# Altium schematic sheet dclass.SCHDOC
size B
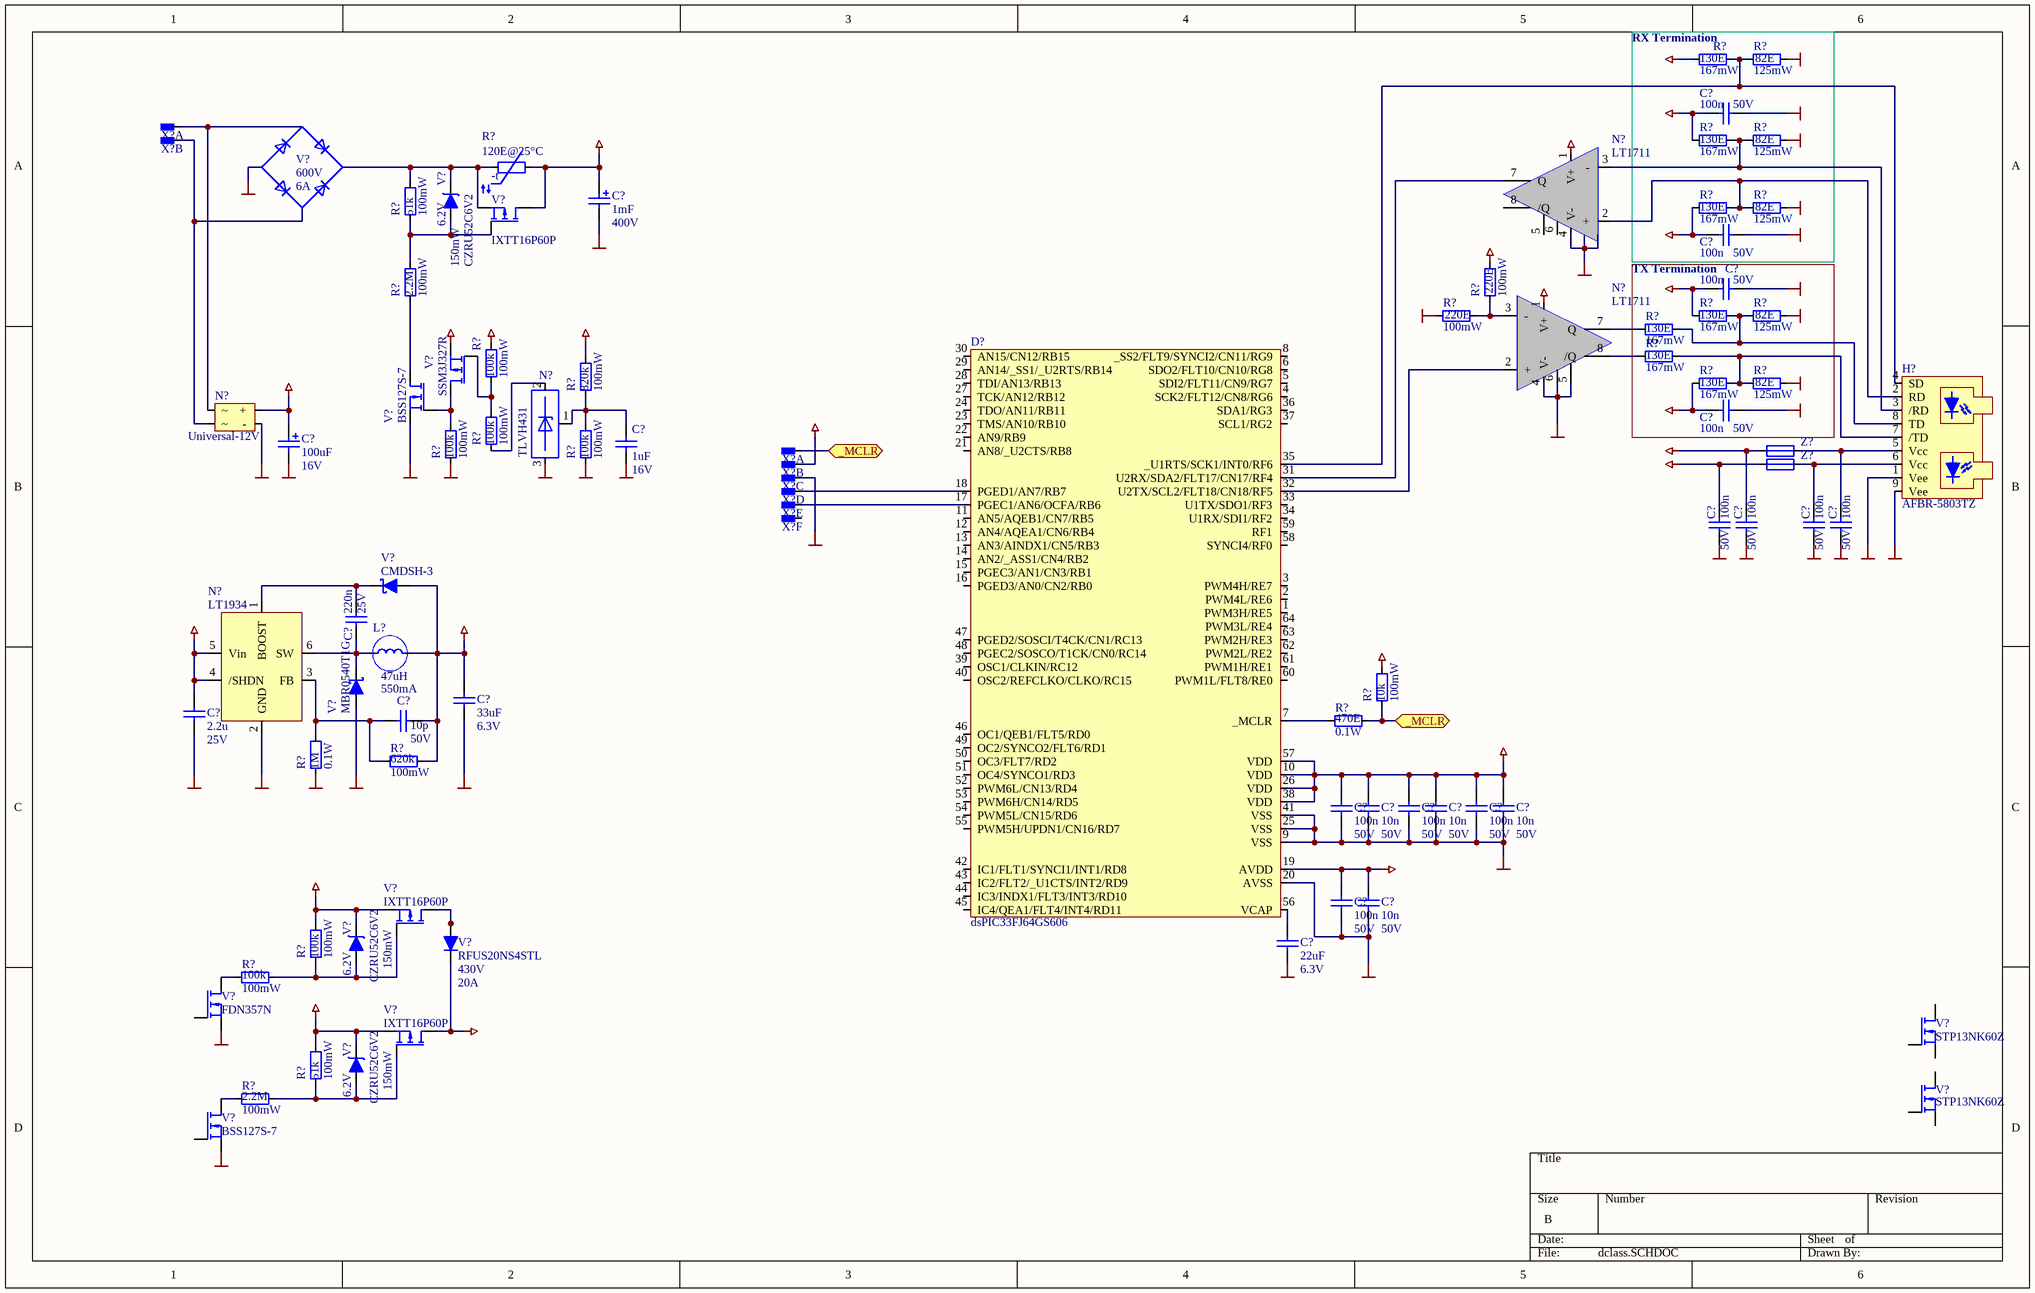
[diagram p0: dclass.SCHDOC]

## Parts
(Parts that share a designator on the sheet are numbered #1, #2 ... from top to bottom, then left to right.)
C?#1  value 100n  Value2: 50V  [SMD_0603]  (hidden comment: C_SMD_CER_100N_50V_10%_X7R_0603)
C?#2  value 1mF  Value2: 400V  [THT_CAP_T2GP102FA]  (hidden comment: C_THT_ALU_1000U_400V_20%_T2GP102FA)
C?#3  value 100n  Value2: 50V  [SMD_0603]  (hidden comment: C_SMD_CER_100N_50V_10%_X7R_0603)
C?#4  value 100n  Value2: 50V  [SMD_0603]  (hidden comment: C_SMD_CER_100N_50V_10%_X7R_0603)
C?#5  value 100n  Value2: 50V  [SMD_0603]  (hidden comment: C_SMD_CER_100N_50V_10%_X7R_0603)
C?#6  value 100uF  Value2: 16V  [SMD_7343P]  (hidden comment: C_SMD_TAN_100U_16V_20%_7343)
C?#7  value 1uF  Value2: 16V  [SMD_0603]  (hidden comment: C_SMD_CER_1U_16V_10%_X5R_0603)
C?#8  value 100n  Value2: 50V  [SMD_0603]  (hidden comment: C_SMD_CER_100N_50V_10%_X7R_0603)
C?#9  value 100n  Value2: 50V  [SMD_0603]  (hidden comment: C_SMD_CER_100N_50V_10%_X7R_0603)
C?#10  value 100n  Value2: 50V  [SMD_0603]  (hidden comment: C_SMD_CER_100N_50V_10%_X7R_0603)
C?#11  value 100n  Value2: 50V  [SMD_0603]  (hidden comment: C_SMD_CER_100N_50V_10%_X7R_0603)
C?#12  value 220n  Value2: 25V  [SMD_0603]  (hidden comment: C_SMD_CER_220N_25V_10%_X5R_0603)
C?#13  value 10p  Value2: 50V  [SMD_0603]  (hidden comment: C_SMD_CER_10P_50V_5%_NP0_0603)
C?#14  value 33uF  Value2: 6.3V  [SMD_1206]  (hidden comment: C_SMD_CER_33U_6V3_20%_X5R_1206)
C?#15  value 2.2u  Value2: 25V  [SMD_0603]  (hidden comment: C_SMD_CER_2U2_25V_10%_X5R_0603)
C?#16  value 100n  Value2: 50V  [SMD_0603]  (hidden comment: C_SMD_CER_100N_50V_10%_X7R_0603)
C?#17  value 10n  Value2: 50V  [SMD_0603]  (hidden comment: C_SMD_CER_10N_50V_10%_X7R_0603)
C?#18  value 100n  Value2: 50V  [SMD_0603]  (hidden comment: C_SMD_CER_100N_50V_10%_X7R_0603)
C?#19  value 10n  Value2: 50V  [SMD_0603]  (hidden comment: C_SMD_CER_10N_50V_10%_X7R_0603)
C?#20  value 100n  Value2: 50V  [SMD_0603]  (hidden comment: C_SMD_CER_100N_50V_10%_X7R_0603)
C?#21  value 10n  Value2: 50V  [SMD_0603]  (hidden comment: C_SMD_CER_10N_50V_10%_X7R_0603)
C?#22  value 100n  Value2: 50V  [SMD_0603]  (hidden comment: C_SMD_CER_100N_50V_10%_X7R_0603)
C?#23  value 10n  Value2: 50V  [SMD_0603]  (hidden comment: C_SMD_CER_10N_50V_10%_X7R_0603)
C?#24  value 22uF  Value2: 6.3V  [SMD_1206]  (hidden comment: C_SMD_CER_22U_6V3_20%_X5R_1206)
D?  Type: dsPIC33FJ64GS606  [SMD_TQFP-64]  (hidden comment: D_DSPIC33FJ64GS606_TQFP-64)
H?  Type: AFBR-5803TZ  [THT_AFBR-5803TZ]  (hidden comment: H_OPTO_TRANSCEIVER_ST_3V3_100MBPS_1300NM)
L?  value 47uH  Value2: 550mA  [SMD_INDUCT-74404041470]  (hidden comment: L_SMD_47U_0A55_20%)
N?#1  Type: LT1711  [SMD_SOP_8]  (hidden comment: N_LT1711_SOP-8)
N?#2  Type: LT1711  [SMD_SOP_8]  (hidden comment: N_LT1711_SOP-8)
N?#3  Type: Universal-12V  [THT_VCP24US12-E]  (hidden comment: N_SMPS_265AC-to-12V_24W)
N?#4  Type: TLVH431  [SMD_SOT_23_3]  (hidden comment: N_TLVH431_SOT23-3)
N?#5  LT1934  [SMD_SOT_23_6]
R?#1  value 130E  Value2: 167mW  [SMD_0603]  (hidden comment: R_SMD_THINFILM_130E_0W16_0.1%_25PPM_0603)
R?#2  value 82E  Value2: 125mW  [SMD_0603]  (hidden comment: R_SMD_THINFILM_82E_0W125_1%_50PPM_0603)
R?#3  value 130E  Value2: 167mW  [SMD_0603]  (hidden comment: R_SMD_THINFILM_130E_0W16_0.1%_25PPM_0603)
R?#4  value 82E  Value2: 125mW  [SMD_0603]  (hidden comment: R_SMD_THINFILM_82E_0W125_1%_50PPM_0603)
R?#5  value 120E@25°C  [THT_R_A_L17.5_D6_P10]  (hidden comment: R_THT_NTC_120E_20%)
R?#6  value 130E  Value2: 167mW  [SMD_0603]  (hidden comment: R_SMD_THINFILM_130E_0W16_0.1%_25PPM_0603)
R?#7  value 82E  Value2: 125mW  [SMD_0603]  (hidden comment: R_SMD_THINFILM_82E_0W125_1%_50PPM_0603)
R?#8  value 51k  Value2: 100mW  [SMD_0603]  (hidden comment: R_SMD_THINFILM_51K_0W1_1%_50PPM_0603)
R?#9  value 2.2M  Value2: 100mW  [SMD_0603]  (hidden comment: R_SMD_THINFILM_2M2_0W1_1%_50PPM_0603)
R?#10  value 220E  Value2: 100mW  [SMD_0603]  (hidden comment: R_SMD_THINFILM_220E_0W1_1%_50PPM_0603)
R?#11  value 220E  Value2: 100mW  [SMD_0603]  (hidden comment: R_SMD_THINFILM_220E_0W1_1%_50PPM_0603)
R?#12  value 130E  Value2: 167mW  [SMD_0603]  (hidden comment: R_SMD_THINFILM_130E_0W16_0.1%_25PPM_0603)
R?#13  value 82E  Value2: 125mW  [SMD_0603]  (hidden comment: R_SMD_THINFILM_82E_0W125_1%_50PPM_0603)
R?#14  value 130E  Value2: 167mW  [SMD_0603]  (hidden comment: R_SMD_THINFILM_130E_0W16_0.1%_25PPM_0603)
R?#15  value 100k  Value2: 100mW  [SMD_0603]  (hidden comment: R_SMD_THINFILM_100K_0W1_1%_50PPM_0603)
R?#16  value 130E  Value2: 167mW  [SMD_0603]  (hidden comment: R_SMD_THINFILM_130E_0W16_0.1%_25PPM_0603)
R?#17  value 130E  Value2: 167mW  [SMD_0603]  (hidden comment: R_SMD_THINFILM_130E_0W16_0.1%_25PPM_0603)
R?#18  value 82E  Value2: 125mW  [SMD_0603]  (hidden comment: R_SMD_THINFILM_82E_0W125_1%_50PPM_0603)
R?#19  value 820k  Value2: 100mW  [SMD_0603]  (hidden comment: R_SMD_THINFILM_820K_0W1_1%_100PPM_0603)
R?#20  value 100k  Value2: 100mW  [SMD_0603]  (hidden comment: R_SMD_THINFILM_100K_0W1_1%_50PPM_0603)
R?#21  value 100k  Value2: 100mW  [SMD_0603]  (hidden comment: R_SMD_THINFILM_100K_0W1_1%_50PPM_0603)
R?#22  value 100k  Value2: 100mW  [SMD_0603]  (hidden comment: R_SMD_THINFILM_100K_0W1_1%_50PPM_0603)
R?#23  value 10k  Value2: 100mW  [SMD_0603]  (hidden comment: R_SMD_THINFILM_10K_0W1_1%_50PPM_0603)
R?#24  value 470E  Value2: 0.1W  [SMD_0603]  (hidden comment: R_SMD_THINFILM_470E_0W1_1%_50PPM_0603)
R?#25  value 1M  Value2: 0.1W  [SMD_0603]  (hidden comment: R_SMD_THINFILM_1M_0W1_1%_50PPM_0603)
R?#26  value 620k  Value2: 100mW  [SMD_0603]  (hidden comment: R_SMD_THINFILM_620K_0W1_1%_50PPM_0603)
R?#27  value 100k  Value2: 100mW  [SMD_0603]  (hidden comment: R_SMD_THINFILM_100K_0W1_1%_50PPM_0603)
R?#28  value 100k  Value2: 100mW  [SMD_0603]  (hidden comment: R_SMD_THINFILM_100K_0W1_1%_50PPM_0603)
R?#29  value 51k  Value2: 100mW  [SMD_0603]  (hidden comment: R_SMD_THINFILM_51K_0W1_1%_50PPM_0603)
R?#30  value 2.2M  Value2: 100mW  [SMD_0603]  (hidden comment: R_SMD_THINFILM_2M2_0W1_1%_50PPM_0603)
V?#1  value 600V  Value2: 6A  [THT_KBU6J]  (hidden comment: V_THT_BRIDGE_RECTIFIER_KBU6J_600V_6A_KBU)
V?#2  Type: IXTT16P60P  [SMD_TO-268-3]  (hidden comment: V_SMD_FET_IXTT16P60P_PMOS_600V_16A_92NC_460W_TO-268-3)
V?#3  value 6.2V  Value2: 150mW  Type: CZRU52C6V2  [SMD_0603P]  (hidden comment: V_SMD_Z-DIODE_CZRU52C6V2_6V2_0W15_5%_0603)
V?#4  Type: SSM3J327R  [SMD_SOT_23_3]  (hidden comment: V_SMD_FET_PMOS_SSM3J327R_20V_6A_4NC6_1W_SOT-23-3)
V?#5  Type: BSS127S-7  [SMD_SOT_23_3]  (hidden comment: V_SMD_FET_NMOS_BSS127S-7_600V_0A05_1NC08_0W61_SOT-23-3)
V?#6  Type: CMDSH-3  [SMD_SOD_323]  (hidden comment: V_SMD_SCHOTTKY_MBR0540T1G_40V_0A5_SOD-123)
V?#7  Type: MBR0540T1G  [SMD_SOD_123]  (hidden comment: V_SMD_SCHOTTKY_MBR0540T1G_40V_0A5_SOD-123)
V?#8  Type: IXTT16P60P  [SMD_TO-268-3]  (hidden comment: V_SMD_FET_IXTT16P60P_PMOS_600V_16A_92NC_460W_TO-268-3)
V?#9  value 430V  Type: RFUS20NS4STL  Value2: 20A  [SMD_TO_263]  (hidden comment: V_SMD_DIODE_RFUS20NS4STL_430V_20A_TO-263-3)
V?#10  value 6.2V  Value2: 150mW  Type: CZRU52C6V2  [SMD_0603P]  (hidden comment: V_SMD_Z-DIODE_CZRU52C6V2_6V2_0W15_5%_0603)
V?#11  Type: FDN357N  [SMD_SOT_23_3]  (hidden comment: V_SMD_FET_NMOS_FDN357N_30V_1A9_4NC2_0W5_SOT-23-3)
V?#12  Type: IXTT16P60P  [SMD_TO-268-3]  (hidden comment: V_SMD_FET_IXTT16P60P_PMOS_600V_16A_92NC_460W_TO-268-3)
V?#13  Type: STP13NK60Z  [THT_TO_220]  (hidden comment: V_THT_FET_NMOS_STP13NK60Z_600V_13A_92NC_150W_TO-220)
V?#14  value 6.2V  Value2: 150mW  Type: CZRU52C6V2  [SMD_0603P]  (hidden comment: V_SMD_Z-DIODE_CZRU52C6V2_6V2_0W15_5%_0603)
V?#15  Type: STP13NK60Z  [THT_TO_220]  (hidden comment: V_THT_FET_NMOS_STP13NK60Z_600V_13A_92NC_150W_TO-220)
V?#16  Type: BSS127S-7  [SMD_SOT_23_3]  (hidden comment: V_SMD_FET_NMOS_BSS127S-7_600V_0A05_1NC08_0W61_SOT-23-3)
X?#1  X_CONNECTOR_P5.08_D1.5_1X2  [THT_CON_P5.08_D1.5_1X2]  (value not drawn)  (part A of 2)
X?#2  X_CONNECTOR_P5.08_D1.5_1X2  [THT_CON_P5.08_D1.5_1X2]  (value not drawn)  (part B of 2)
X?#3  X_CONNECTOR_P2.54_D0.9_1X6  [THT_CON_P2.54_D0.9_1X6]  (value not drawn)  (part A of 6)
X?#4  X_CONNECTOR_P2.54_D0.9_1X6  [THT_CON_P2.54_D0.9_1X6]  (value not drawn)  (part B of 6)
X?#5  X_CONNECTOR_P2.54_D0.9_1X6  [THT_CON_P2.54_D0.9_1X6]  (value not drawn)  (part C of 6)
X?#6  X_CONNECTOR_P2.54_D0.9_1X6  [THT_CON_P2.54_D0.9_1X6]  (value not drawn)  (part D of 6)
X?#7  X_CONNECTOR_P2.54_D0.9_1X6  [THT_CON_P2.54_D0.9_1X6]  (value not drawn)  (part E of 6)
X?#8  X_CONNECTOR_P2.54_D0.9_1X6  [THT_CON_P2.54_D0.9_1X6]  (value not drawn)  (part F of 6)
Z?#1  Z_SMD_FERRITE_1A5_470E@100MHZ_0603  [SMD_0603]  (value not drawn)
Z?#2  Z_SMD_FERRITE_1A5_470E@100MHZ_0603  [SMD_0603]  (value not drawn)

## Blocks framed on the sheet
RX Termination: C?#1 C?#3 R?#1-R?#4 R?#6 R?#7
TX Termination: C?#4 C?#5 R?#12-R?#14 R?#16-R?#18

## Ports
_MCLR

## Nets
+3.3V: C?#1.2 C?#3.2 C?#4.2 C?#5.2 C?#8.1 C?#10.2 C?#13.1 C?#14.2 C?#16.2 C?#17.2 C?#18.2 C?#19.2 C?#20.2 C?#21.2 C?#22.2 C?#23.2 D?.10(VDD) D?.19(AVDD) D?.26(VDD) D?.38(VDD) D?.57(VDD) L?.2 N?#1.1(V+) N?#2.1(V+) R?#1.2 R?#3.2 R?#6.2 R?#10.2 R?#12.2 R?#17.2 R?#23.2 R?#26.1 V?#6.1 X?#4.2 Z?#1.2 Z?#2.2
+12V: C?#6.2 C?#15.2 N?#3.3(+) N?#5.4(/SHDN) N?#5.5(Vin) R?#15.1 R?#19.2 R?#27.2 V?#4.2(Source) V?#8.3(Source) V?#10.2
+325V: C?#2.2 R?#5.2 R?#29.2 V?#2.2(Drain) V?#12.3(Source) V?#14.2
GND: C?#1.1 C?#2.1 C?#3.1 C?#4.1 C?#5.1 C?#6.1 C?#7.1 C?#8.2 C?#9.2 C?#10.1 C?#11.1 C?#14.1 C?#15.1 C?#16.1 C?#17.1 C?#18.1 C?#19.1 C?#20.1 C?#21.1 C?#22.1 C?#23.1 C?#24.1 D?.9(VSS) D?.20(AVSS) D?.25(VSS) D?.41(VSS) H?.1(Vee) H?.9(Vee) N?#1.4(V-) N?#2.4(V-) N?#2.5(LATCH_ENABLE) N?#2.6(GND) N?#3.4(-) N?#4.3 N?#5.2(GND) R?#2.2 R?#4.2 R?#7.2 R?#11.1 R?#13.2 R?#18.2 R?#21.1 R?#22.1 R?#25.2 V?#1.4 V?#5.2(Source) V?#7.1 V?#11.2(Source) V?#16.2(Source) X?#5.3
Vdriver: V?#9.2 V?#12.2(Drain)
_MCLR: R?#23.1 R?#24.1 X?#3.1 ; port _MCLR
NetC?#7_2: C?#7.2 N?#4.1 R?#19.1 R?#22.2
NetC?#9_1: C?#9.1 H?.5(Vcc) Z?#1.1
NetC?#11_2: C?#11.2 H?.6(Vcc) Z?#2.1
NetC?#12_1: C?#12.1 L?.1 N?#5.6(SW) V?#7.2
NetC?#12_2: C?#12.2 N?#5.1(BOOST) V?#6.2
NetC?#13_2: C?#13.2 N?#5.3(FB) R?#25.1 R?#26.2
NetC?#24_2: C?#24.2 D?.56(VCAP)
NetD?_7: D?.7(_MCLR) R?#24.2
NetD?_17: D?.17(PGEC1/AN6/OCFA/RB6) X?#7.5
NetD?_18: D?.18(PGED1/AN7/RB7) X?#6.4
NetD?_31: D?.31(U2RX/SDA2/FLT17/CN17/RF4) N?#1.7(Q)
NetD?_32: D?.32(U2TX/SCL2/FLT18/CN18/RF5) N?#2.2(+)
NetD?_35: D?.35(_U1RTS/SCK1/INT0/RF6) H?.4(SD) R?#1.1 R?#2.1
NetH?_2: H?.2(RD) N?#1.2(+) R?#6.1 R?#7.1
NetH?_3: H?.3(/RD) N?#1.3(-) R?#3.1 R?#4.1
NetH?_7: H?.7(/TD) R?#16.1 R?#17.1 R?#18.1
NetH?_8: H?.8(TD) R?#12.1 R?#13.1 R?#14.1
NetN?#2_3: N?#2.3(-) R?#10.1 R?#11.2
NetN?#2_7: N?#2.7(Q) R?#14.2
NetN?#2_8: N?#2.8(/Q) R?#16.2
NetN?#3_1: N?#3.1 V?#1.2 X?#1.1
NetN?#3_2: N?#3.2 V?#1.3 X?#2.2
NetN?#4_2: N?#4.2 R?#20.2
NetR?#5_1: R?#5.1 R?#8.2 V?#1.1 V?#2.3(Source) V?#3.2
NetR?#8_1: R?#8.1 R?#9.2 V?#2.1(Gate) V?#3.1
NetR?#9_1: R?#9.1 V?#5.3(Drain)
NetR?#15_2: R?#15.2 R?#20.1 V?#4.1(Gate)
NetR?#21_2: R?#21.2 V?#4.3(Drain) V?#5.1(Gate)
NetR?#27_1: R?#27.1 R?#28.1 V?#8.1(Gate) V?#10.1
NetR?#28_2: R?#28.2 V?#11.3(Drain)
NetR?#29_1: R?#29.1 R?#30.2 V?#12.1(Gate) V?#14.1
NetR?#30_1: R?#30.1 V?#16.3(Drain)
NetV?#8_2: V?#8.2(Drain) V?#9.1 V?#9.3

Not connected (* = marked no-connect by the designer): C?#2 3 4; D? 1(PWM3H/RE5) 2(PWM4L/RE6) 3(PWM4H/RE7) 4(SCK2/FLT12/CN8/RG6) 5(SDI2/FLT11/CN9/RG7) 6(SDO2/FLT10/CN10/RG8) 8(_SS2/FLT9/SYNCI2/CN11/RG9) 11(AN5/AQEB1/CN7/RB5) 12(AN4/AQEA1/CN6/RB4) 13(AN3/AINDX1/CN5/RB3) 14(AN2/_ASS1/CN4/RB2) 15(PGEC3/AN1/CN3/RB1) 16(PGED3/AN0/CN2/RB0) 21(AN8/_U2CTS/RB8) 22(AN9/RB9) 23(TMS/AN10/RB10) 24(TDO/AN11/RB11) 27(TCK/AN12/RB12) 28(TDI/AN13/RB13) 29(AN14/_SS1/_U2RTS/RB14) 30(AN15/CN12/RB15) 33(U1TX/SDO1/RF3) 34(U1RX/SDI1/RF2) 36(SDA1/RG3) 37(SCL1/RG2) 39(OSC1/CLKIN/RC12) 40(OSC2/REFCLKO/CLKO/RC15) 42(IC1/FLT1/SYNCI1/INT1/RD8) 43(IC2/FLT2/_U1CTS/INT2/RD9) 44(IC3/INDX1/FLT3/INT3/RD10) 45(IC4/QEA1/FLT4/INT4/RD11) 46(OC1/QEB1/FLT5/RD0) 47(PGED2/SOSCI/T4CK/CN1/RC13) 48(PGEC2/SOSCO/T1CK/CN0/RC14) 49(OC2/SYNCO2/FLT6/RD1) 50(OC3/FLT7/RD2) 51(OC4/SYNCO1/RD3) 52(PWM6L/CN13/RD4) 53(PWM6H/CN14/RD5) 54(PWM5L/CN15/RD6) 55(PWM5H/UPDN1/CN16/RD7) 58(SYNCI4/RF0) 59(RF1) 60(PWM1L/FLT8/RE0) 61(PWM1H/RE1) 62(PWM2L/RE2) 63(PWM2H/RE3) 64(PWM3L/RE4); N?#1 5(LATCH_ENABLE) 6(GND) 8(/Q); V?#11 1(Gate); V?#13 1(Gate) 2(Drain) 3(Source); V?#15 1(Gate) 2(Drain) 3(Source); V?#16 1(Gate); X?#8 6

## Notes on the sheet
- (in symbol R_THT_NTC_120E_20%) -t

## Library data of the parts
C?#1 C?#3-C?#5 C?#8-C?#11 C?#16 C?#18 C?#20 C?#22 = C_SMD_CER_100N_50V_10%_X7R_0603: SMD Capacitor; Supplier - E+H-flowtec SAP: 50092748
C?#2 = C_THT_ALU_1000U_400V_20%_T2GP102FA: THT Aluminum capacitor; Type: ECE-T2GP102FA; Supplier - Digikey: P10064-ND
C?#6 = C_SMD_TAN_100U_16V_20%_7343: SMD Tantal Capacitor; Supplier - E+H-flowtec SAP: 50103975
C?#7 = C_SMD_CER_1U_16V_10%_X5R_0603: SMD Capacitor; Supplier - E+H-flowtec SAP: 50106956
C?#12 = C_SMD_CER_220N_25V_10%_X5R_0603: SMD Capacitor; Supplier - Digikey: 478-1245-1-ND
C?#13 = C_SMD_CER_10P_50V_5%_NP0_0603: SMD Capacitor; Supplier - E+H-flowtec SAP: 50092727
C?#15 = C_SMD_CER_2U2_25V_10%_X5R_0603: SMD Capacitor; Supplier - Digikey: 587-2909-1-ND
C?#17 C?#19 C?#21 C?#23 = C_SMD_CER_10N_50V_10%_X7R_0603: SMD Capacitor; Supplier - E+H-flowtec SAP: 50092743
C?#24 = C_SMD_CER_22U_6V3_20%_X5R_1206: SMD Capacitor; Supplier - E+H-flowtec SAP: 71128390
D? = D_DSPIC33FJ64GS606_TQFP-64: 16-Bit Digital Signal Controllers with High-Speed PWM, / ADC and Comparators; Supplier - Digikey: DSPIC33FJ64GS606-I/PT-ND
L? = L_SMD_47U_0A55_20%: SMD Inductor; Supplier - Digikey: 732-7230-1-ND
N?#1 N?#2 = N_LT1711_SOP-8: Rail-to-rail Voltage Comparator; Supplier - Digikey: LT1711CMS8#PBF-ND
N?#4 = N_TLVH431_SOT23-3: LOW-VOLTAGE ADJUSTABLE PRECISION SHUNT REGULATORS; Supplier - E+H-flowtec SAP: 71120701
N?#5 = N_LT1934_SOT-23-6: Micropower Step-Down Switching Regulators; Supplier - Digikey: LT1934ES6#TRMPBFCT-ND; Type: LT1934
R?#2 R?#4 R?#7 R?#13 R?#18 = R_SMD_THINFILM_82E_0W125_1%_50PPM_0603: SMD Resistor; Supplier - Digikey: MCT06030C8209FP500-ND
R?#5 = R_THT_NTC_120E_20%: CURRENT LIMITER INRUSH 120OHM 20%; Supplier - Digikey: 317-1221-ND
R?#8 R?#29 = R_SMD_THINFILM_51K_0W1_1%_50PPM_0603: SMD Resistor; Supplier - E+H-flowtec SAP: 50092709
R?#9 R?#30 = R_SMD_THINFILM_2M2_0W1_1%_50PPM_0603: SMD Resistor; Supplier - E+H-flowtec SAP: 50092790
R?#10 R?#11 = R_SMD_THINFILM_220E_0W1_1%_50PPM_0603: SMD Resistor; Supplier - E+H-flowtec SAP: 50092678
R?#15 R?#20-R?#22 R?#27 R?#28 = R_SMD_THINFILM_100K_0W1_1%_50PPM_0603: SMD Resistor; Supplier - E+H-flowtec SAP: 50092714
R?#19 = R_SMD_THINFILM_820K_0W1_1%_100PPM_0603: SMD Resistor; Supplier - E+H-flowtec SAP: 71211650
R?#23 = R_SMD_THINFILM_10K_0W1_1%_50PPM_0603: SMD Resistor; Supplier - E+H-flowtec SAP: 50092700
R?#24 = R_SMD_THINFILM_470E_0W1_1%_50PPM_0603: SMD Resistor; Supplier - E+H-flowtec SAP: 50092681
R?#25 = R_SMD_THINFILM_1M_0W1_1%_50PPM_0603: SMD Resistor; Supplier - E+H-flowtec SAP: 50092725
R?#26 = R_SMD_THINFILM_620K_0W1_1%_50PPM_0603: SMD Resistor; Supplier - E+H-flowtec SAP: 71164284
V?#1 = V_THT_BRIDGE_RECTIFIER_KBU6J_600V_6A_KBU: Bridge Recitifer; Type: KBU6J; Supplier - E+H-flowtec SAP: 71025862
V?#2 V?#8 V?#12 = V_SMD_FET_PMOS_600V_16A_92NC_460W_TO-268-3: P-Channel Power MOSFET; Supplier - Digikey: IXTT16P60P-ND
V?#3 V?#10 V?#14 = V_SMD_Z-DIODE_CZRU52C6V2_6V2_0W15_5%_0603: Zener Diode, 6.2V; Supplier - Digikey: 641-1031-1-ND
V?#5 V?#16 = V_SMD_FET_NMOS_BSS127S-7_600V_0A05_1NC08_0W61_SOT-23-3: N-Channel Logic Level Enhancement Mode Field Effect Transistor; Supplier - Digikey: BSS127S-7DICT-ND
V?#6 = V_SMD_SCHOTTKY_CMDSH-3_30V_0A1_SOD-323_1: Schottky diode, 30V, 100mA, SOD-323; Supplier - Digikey: CMDSH-3 CT-ND
V?#7 = V_SMD_SCHOTTKY_MBR0540T1G_40V_0A5_SOD-123: Schottky diode, 40V, 500mA, SOD-123; Supplier - Digikey: MBR0540T1GOSCT-ND
V?#9 = V_SMD_DIODE_RFUS20NS4STL_430V_20A_TO-263-3: Super Fast Recovery Diode; pin to pad: 2>4; Supplier - Digikey: RFUS20NS4STLCT-ND
V?#11 = V_SMD_FET_NMOS_FDN357N_30V_1A9_4NC2_0W5_SOT-23-3: N-Channel Logic Level Enhancement Mode Field Effect Transistor; Supplier - E+H-flowtec SAP: 50110216
V?#13 V?#15 = V_THT_FET_NMOS_STP13NK60Z_600V_13A_92NC_150W_TO-220: Value: 600V; Value2: 13A; Supplier - Digikey: 497-3182-5-ND
X?#1 X?#2 = X_CONNECTOR_P5.08_D1.5_1X2: Pitch 5.08, Diameter 1.5mm, 1 row, 2 columns; Type: Pitch 2.54, Diameter 0.9mm, 1 row, 2 columns
X?#3-X?#8 = X_CONNECTOR_P2.54_D0.9_1X6: Pitch 2.54, Diameter 0.9mm, 1 row, 6 columns; Type: Pitch 2.54, Diameter 0.9mm, 1 row, 3 columns
Z?#1 Z?#2 = Z_SMD_FERRITE_1A5_470E@100MHZ_0603: FERRITE CHIP 470 OHM 1500MA 0603; Value: 1.5A; Supplier - Digikey: 490-5257-1-ND; Type: BLM18KG471SN1D
C?#14 = C_SMD_CER_33U_6V3_20%_X5R_1206: Supplier - Digikey: 445-4060-1-ND
H? = H_OPTO_TRANSCEIVER_ST_3V3_100MBPS_1300NM: Supplier - Digikey: 516-1990-ND
N?#3 = N_SMPS_265AC-to-12V_24W: Supplier - Digikey: 1470-2272-ND
R?#1 R?#3 R?#6 R?#12 R?#14 R?#16 R?#17 = R_SMD_THINFILM_130E_0W16_0.1%_25PPM_0603: Supplier - Digikey: A110023CT-ND
V?#4 = V_SMD_FET_PMOS_SSM3J327R_20V_6A_4NC6_1W_SOT-23-3: Supplier - Digikey: SSM3J327RLFCT-ND